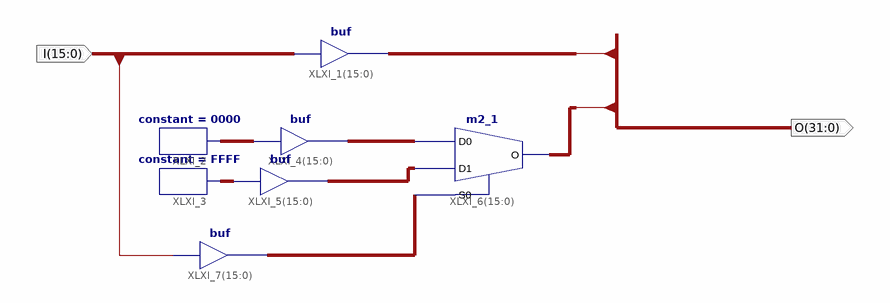
[diagram p0: schematic sheet 1]
// Xilinx ISE schematic sign_extend.sch (spartan3) as structural Verilog: 7 symbols, 2 ports
module sign_extend (
  input  [15:0] I,
  output [31:0] O
);

  wire [15:0] XLXN_6, XLXN_7, XLXN_9, XLXN_17, XLXN_18;

  assign O[15:0] = I;  // buf XLXI_1[15..0], 16 bits wide
  constant #(.CValue("0000")) XLXI_2 (.O(XLXN_17));
  constant #(.CValue("FFFF")) XLXI_3 (.O(XLXN_18));
  assign XLXN_6 = XLXN_17;  // buf XLXI_4[15..0], 16 bits wide
  assign XLXN_7 = XLXN_18;  // buf XLXI_5[15..0], 16 bits wide
  m2_1 XLXI_6[15:0] (.D0(XLXN_6), .D1(XLXN_7), .S0(XLXN_9), .O(O[31:16]));
  assign XLXN_9 = {16{I[15]}};  // buf XLXI_7[15..0], 16 bits wide
endmodule
